# EAGLE design MTQHub (EAGLE 8.7.1)
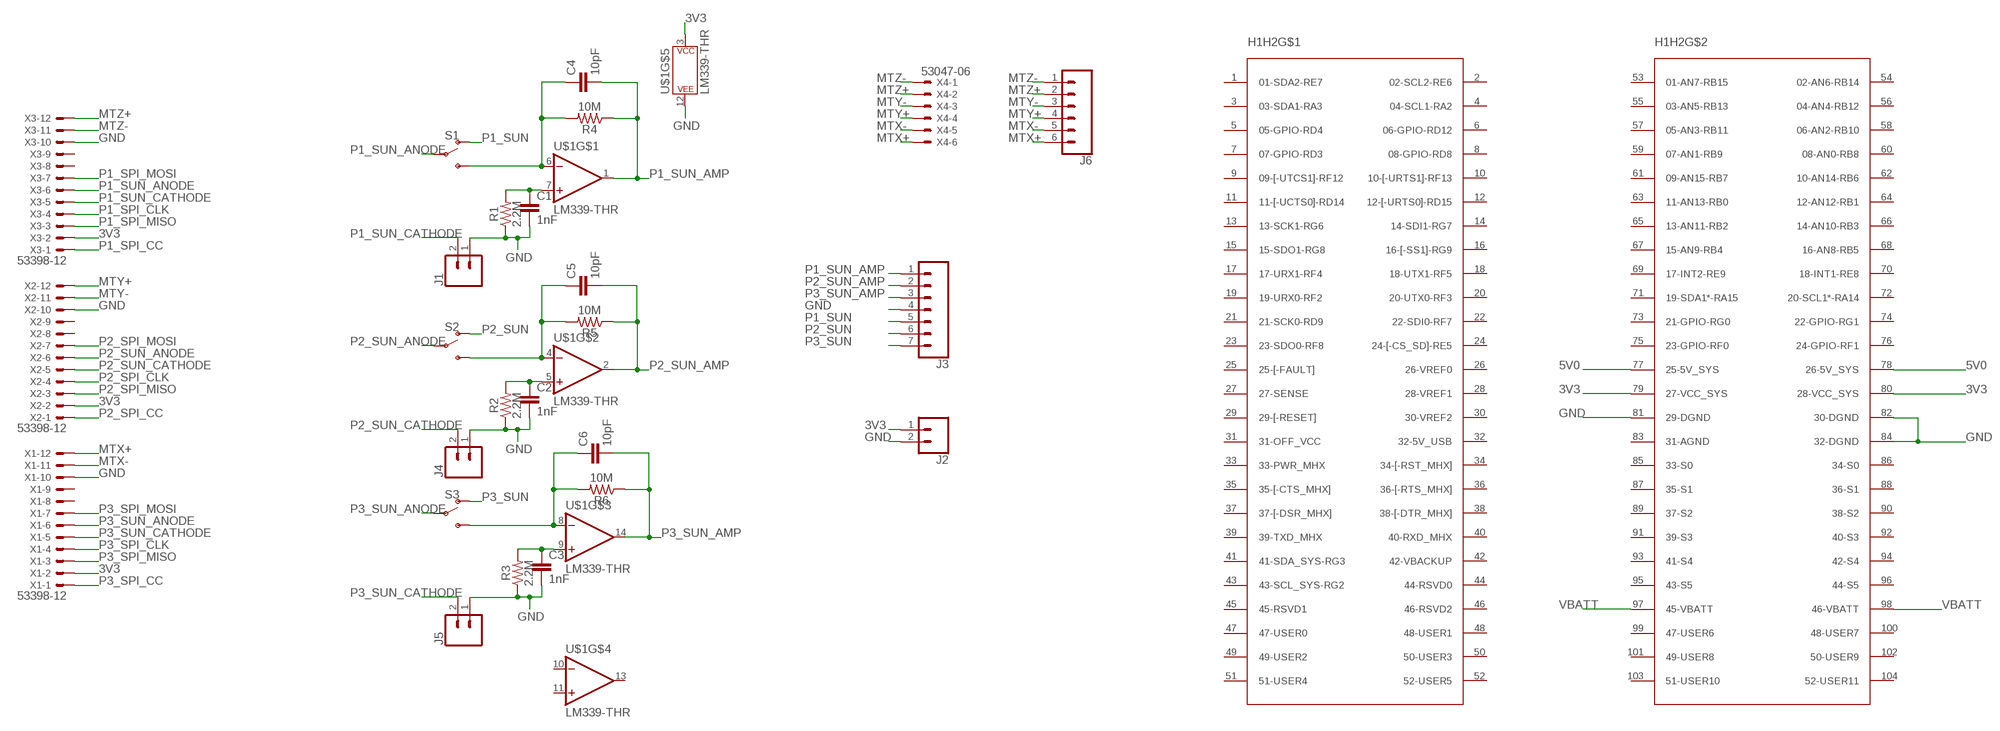
[diagram p0: schematic, sheet 1]

## Parts
C1  1nF  1.0NF/1000PF-0603-50V-10%  [0603]
C2  1nF  1.0NF/1000PF-0603-50V-10%  [0603]
C3  1nF  1.0NF/1000PF-0603-50V-10%  [0603]
C4  10pF  10PF-0603-50V-5%  [0603]
C5  10pF  10PF-0603-50V-5%  [0603]
C6  10pF  10PF-0603-50V-5%  [0603]
H1H2  PC104_CONN  [PC_104]
J1  CONN_02  [1X02]
J2  CONN_02  [1X02]
J3  CONN_07  [1X07]
J4  CONN_02  [1X02]
J5  CONN_02  [1X02]
J6  CONN_06SILK_FEMALE_PTH  [1X06]
R1  2.2M  RESISTOR0603  [0603]
R2  2.2M  RESISTOR0603  [0603]
R3  2.2M  RESISTOR0603  [0603]
R4  10M  RESISTOR0603  [0603]
R5  10M  RESISTOR0603  [0603]
R6  10M  RESISTOR0603  [0603]
S1  SWITCH-SPDT-PTH-11.6X4.0MM  [SWITCH_SPDT_PTH_11.6X4.0MM]
S2  SWITCH-SPDT-PTH-11.6X4.0MM  [SWITCH_SPDT_PTH_11.6X4.0MM]
S3  SWITCH-SPDT-PTH-11.6X4.0MM  [SWITCH_SPDT_PTH_11.6X4.0MM]
U$1  LM339-THR  [DIL14]
X1  53398-12  [53398-12]
X2  53398-12  [53398-12]
X3  53398-12  [53398-12]
X4  53047-06  [53047-06]

## Nets
3V3: H1H2.79(27-VCC_SYS) H1H2.80(28-VCC_SYS) J2.1 U$1.3(P$V+) X1.2 X2.2 X3.2
5V0: H1H2.77(25-5V_SYS) H1H2.78(26-5V_SYS)
GND: C1.2 C2.2 C3.2 H1H2.81(29-DGND) H1H2.82(30-DGND) H1H2.84(32-DGND) J1.1 J2.2 J3.4 J4.1 J5.1 R1.1 R2.1 R3.1 U$1.12(P$V-) X1.10 X2.10 X3.10
MTX+: J6.6 X1.12 X4.6
MTX-: J6.5 X1.11 X4.5
MTY+: J6.4 X2.12 X4.4
MTY-: J6.3 X2.11 X4.3
MTZ+: J6.2 X3.12 X4.2
MTZ-: J6.1 X3.11 X4.1
N$2: C1.1 R1.2 U$1.7(+IN)
N$4: C2.1 R2.2 U$1.5(+IN)
N$6: C3.1 R3.2 U$1.9(+IN)
N$9: C4.1 R4.2 S1.3(S) U$1.6(-IN)
N$11: C5.1 R5.2 S2.3(S) U$1.4(-IN)
N$13: C6.1 R6.2 S3.3(S) U$1.8(-IN)
P1_SPI_CC: X3.1
P1_SPI_CLK: X3.4
P1_SPI_MISO: X3.3
P1_SPI_MOSI: X3.7
P1_SUN: J3.5 S1.1(O)
P1_SUN_AMP: C4.2 J3.1 R4.1 U$1.1(OUT)
P1_SUN_ANODE: S1.2(P) X3.6
P1_SUN_CATHODE: J1.2 X3.5
P2_SPI_CC: X2.1
P2_SPI_CLK: X2.4
P2_SPI_MISO: X2.3
P2_SPI_MOSI: X2.7
P2_SUN: J3.6 S2.1(O)
P2_SUN_AMP: C5.2 J3.2 R5.1 U$1.2(OUT)
P2_SUN_ANODE: S2.2(P) X2.6
P2_SUN_CATHODE: J4.2 X2.5
P3_SPI_CC: X1.1
P3_SPI_CLK: X1.4
P3_SPI_MISO: X1.3
P3_SPI_MOSI: X1.7
P3_SUN: J3.7 S3.1(O)
P3_SUN_AMP: C6.2 J3.3 R6.1 U$1.14(OUT)
P3_SUN_ANODE: S3.2(P) X1.6
P3_SUN_CATHODE: J5.2 X1.5
VBATT: H1H2.97(45-VBATT) H1H2.98(46-VBATT)
Unconnected: H1H2.1(01-SDA2-RE7) H1H2.2(02-SCL2-RE6) H1H2.3(03-SDA1-RA3) H1H2.4(04-SCL1-RA2) H1H2.5(05-GPIO-RD4) H1H2.6(06-GPIO-RD12) H1H2.7(07-GPIO-RD3) H1H2.8(08-GPIO-RD8) H1H2.9(09-[-UTCS1]-RF12) H1H2.10(10-[-URTS1]-RF13) H1H2.11(11-[-UCTS0]-RD14) H1H2.12(12-[-URTS0]-RD15) H1H2.13(13-SCK1-RG6) H1H2.14(14-SDI1-RG7) H1H2.15(15-SDO1-RG8) H1H2.16(16-[-SS1]-RG9) H1H2.17(17-URX1-RF4) H1H2.18(18-UTX1-RF5) H1H2.19(19-URX0-RF2) H1H2.20(20-UTX0-RF3) H1H2.21(21-SCK0-RD9) H1H2.22(22-SDI0-RF7) H1H2.23(23-SDO0-RF8) H1H2.24(24-[-CS_SD]-RE5) H1H2.25(25-[-FAULT]) H1H2.26(26-VREF0) H1H2.27(27-SENSE) H1H2.28(28-VREF1) H1H2.29(29-[-RESET]) H1H2.30(30-VREF2) H1H2.31(31-OFF_VCC) H1H2.32(32-5V_USB) H1H2.33(33-PWR_MHX) H1H2.34(34-[-RST_MHX]) H1H2.35(35-[-CTS_MHX]) H1H2.36(36-[-RTS_MHX]) H1H2.37(37-[-DSR_MHX]) H1H2.38(38-[-DTR_MHX]) H1H2.39(39-TXD_MHX) H1H2.40(40-RXD_MHX) H1H2.41(41-SDA_SYS-RG3) H1H2.42(42-VBACKUP) H1H2.43(43-SCL_SYS-RG2) H1H2.44(44-RSVD0) H1H2.45(45-RSVD1) H1H2.46(46-RSVD2) H1H2.47(47-USER0) H1H2.48(48-USER1) H1H2.49(49-USER2) H1H2.50(50-USER3) H1H2.51(51-USER4) H1H2.52(52-USER5) H1H2.53(01-AN7-RB15) H1H2.54(02-AN6-RB14) H1H2.55(03-AN5-RB13) H1H2.56(04-AN4-RB12) H1H2.57(05-AN3-RB11) H1H2.58(06-AN2-RB10) H1H2.59(07-AN1-RB9) H1H2.60(08-AN0-RB8) H1H2.61(09-AN15-RB7) H1H2.62(10-AN14-RB6) H1H2.63(11-AN13-RB0) H1H2.64(12-AN12-RB1) H1H2.65(13-AN11-RB2) H1H2.66(14-AN10-RB3) H1H2.67(15-AN9-RB4) H1H2.68(16-AN8-RB5) H1H2.69(17-INT2-RE9) H1H2.70(18-INT1-RE8) H1H2.71(19-SDA1*-RA15) H1H2.72(20-SCL1*-RA14) H1H2.73(21-GPIO-RG0) H1H2.74(22-GPIO-RG1) H1H2.75(23-GPIO-RF0) H1H2.76(24-GPIO-RF1) H1H2.83(31-AGND) H1H2.85(33-S0) H1H2.86(34-S0) H1H2.87(35-S1) H1H2.88(36-S1) H1H2.89(37-S2) H1H2.90(38-S2) H1H2.91(39-S3) H1H2.92(40-S3) H1H2.93(41-S4) H1H2.94(42-S4) H1H2.95(43-S5) H1H2.96(44-S5) H1H2.99(47-USER6) H1H2.100(48-USER7) H1H2.101(49-USER8) H1H2.102(50-USER9) H1H2.103(51-USER10) H1H2.104(52-USER11) U$1.10(-IN) U$1.11(+IN) U$1.13(OUT) X1.8 X1.9 X2.8 X2.9 X3.8 X3.9

## Library data of the parts
C1-C3 = SparkFun-Capacitors:1.0NF/1000PF: 1nF/1,000pF ceramic capacitors A capacitor is a passive two-terminal electrical component used to store electrical energy temporarily in an electric field.; PROD_ID: CAP-07886
C4-C6 = SparkFun-Capacitors:10PF: 10pF ceramic capacitors A capacitor is a passive two-terminal electrical component used to store electrical energy temporarily in an electric field.; PROD_ID: CAP-11812
H1H2 = SUCHAI:PC104_CONN
J1 J2 J4 J5 = SparkFun-Connectors:CONN_02: Multi connection point. Often used as Generic Header-pin footprint for 0.1 inch spaced/style header connections On any of the 0.1 inch spaced packages, you can populate with these: Break Away Headers - Straight <https://www.sparkfun.com/products/116> (PRT-00116) Break Away Male Headers - Right Angle <https://www.sparkfun.com/products/553> (PRT-00553) Female Headers <https://www.sparkfun.com/products/115> (PRT-00115) Break Away Headers - Machine Pin <https://www.sparkfun.com/products/117> (PRT-00117) Break Away Female Headers - Swiss Machine Pin <https://www.sparkfun.com/products/743> (PRT-00743) For SCREWTERMINALS and SPRING TERMINALS visit here: Screw Terimnals on SparkFun.com <https://www.sparkfun.com/search/results?term=Screw+Terminals> (5mm/3.5mm/2.54mm spacing) This device is also useful as a general connection point to wire up your design to another part of your project. Our various solder wires solder well into these plated through hole pads. Hook-Up Wire - Assortment (Stranded, 22 AWG) <https://www.sparkfun.com/products/11375> (PRT-11375) Hook-Up Wire - Assortment (Solid Core, 22 AWG) <https://www.sparkfun.com/products/11367> (PRT-11367) View the entire wire category on our website here <https://www.sparkfun.com/categories/141> Special notes: Molex polarized connector foot print use with: PRT-08233 with associated crimp pins and housings. 2.54_SCREWTERM for use with PRT-10571. 3.5mm Screw Terminal footprints for PRT-08084 5mm Screw Terminal footprints for use with PRT-08432
J3 = SparkFun-Connectors:CONN_07: Multi connection point. Often used as Generic Header-pin footprint for 0.1 inch spaced/style header connections On any of the 0.1 inch spaced packages, you can populate with these: Break Away Headers - Straight <https://www.sparkfun.com/products/116> (PRT-00116) Break Away Male Headers - Right Angle <https://www.sparkfun.com/products/553> (PRT-00553) Female Headers <https://www.sparkfun.com/products/115> (PRT-00115) Break Away Headers - Machine Pin <https://www.sparkfun.com/products/117> (PRT-00117) Break Away Female Headers - Swiss Machine Pin <https://www.sparkfun.com/products/743> (PRT-00743) For SCREWTERMINALS and SPRING TERMINALS visit here: Screw Terimnals on SparkFun.com <https://www.sparkfun.com/search/results?term=Screw+Terminals> (5mm/3.5mm/2.54mm spacing) This device is also useful as a general connection point to wire up your design to another part of your project. Our various solder wires solder well into these plated through hole pads. Hook-Up Wire - Assortment (Stranded, 22 AWG) <https://www.sparkfun.com/products/11375> (PRT-11375) Hook-Up Wire - Assortment (Solid Core, 22 AWG) <https://www.sparkfun.com/products/11367> (PRT-11367) View the entire wire category on our website here <https://www.sparkfun.com/categories/141> Special notes: Molex polarized connector foot print use with SKU : PRT-08231 with associated crimp pins and housings. 1MM SMD Version SKU: PRT-10208 NOTES ON THE VARIANTS LOCK and LOCK_LONGPADS... This footprint was designed to help hold the alignment of a through-hole component (i.e. 6-pin header) while soldering it into place. You may notice that each hole has been shifted either up or down by 0.005 of an inch from it's more standard position (which is a perfectly straight line). This slight alteration caused the pins (the squares in the middle) to touch the edges of the holes. Because they are alternating, it causes a "brace" to hold the component in place. 0.005 has proven to be the perfect amount of "off-center" position when using our standard breakaway headers. Although looks a little odd when you look at the bare footprint, once you have a header in there, the alteration is very hard to notice. Also,if you push a header all the way into place, it is covered up entirely on the bottom side.
J6 = SparkFun-Connectors:CONN_06: Multi connection point. Often used as Generic Header-pin footprint for 0.1 inch spaced/style header connections On any of the 0.1 inch spaced packages, you can populate with these: Break Away Headers - Straight <https://www.sparkfun.com/products/116> (PRT-00116) Break Away Male Headers - Right Angle <https://www.sparkfun.com/products/553> (PRT-00553) Female Headers <https://www.sparkfun.com/products/115> (PRT-00115) Break Away Headers - Machine Pin <https://www.sparkfun.com/products/117> (PRT-00117) Break Away Female Headers - Swiss Machine Pin <https://www.sparkfun.com/products/743> (PRT-00743) Arduino Stackable Header - 6 Pin <https://www.sparkfun.com/products/9280> (PRT-09280) For SCREWTERMINALS and SPRING TERMINALS visit here: Screw Terimnals on SparkFun.com <https://www.sparkfun.com/search/results?term=Screw+Terminals> (5mm/3.5mm/2.54mm spacing) This device is also useful as a general connection point to wire up your design to another part of your project. Our various solder wires solder well into these plated through hole pads. Hook-Up Wire - Assortment (Stranded, 22 AWG) <https://www.sparkfun.com/products/11375> (PRT-11375) Hook-Up Wire - Assortment (Solid Core, 22 AWG) <https://www.sparkfun.com/products/11367> (PRT-11367) View the entire wire category on our website here <https://www.sparkfun.com/categories/141>; PROD_ID: CONN-08437
R1-R6 = SparkFun-Resistors:RESISTOR: Generic Resistor Package
S1-S3 = SparkFun-Switches:SWITCH-SPDT: Single Pole, Double Throw (SPDT) Switch Single-pole, double-throw (SPDT) switch. Variant Overview SMD-AYZ0202 Surface Mount DPDT Switch <https://www.sparkfun.com/products/597> (COM-00597) Used on e.g. LilyPad Arduino USB - ATmega32U4 Board <https://www.sparkfun.com/products/12049> PTH-11.6X4.0MM SPDT Mini Power Switch <https://www.sparkfun.com/products/102> (COM-00102) Used on e.g. SparkFun Simon Says - Through-Hole Soldering Kit <https://www.sparkfun.com/products/10547> (KIT-10547) PTH-11.6X4.0MM-KIT KIT version of SPDT Mini Power Switch - Simplifies soldering by removing tStop of switch pins - only one side can be soldered. PTH-11.6X4.0MM-LOCK LOCK version of SPDT Mini Power Switch - Offset pins hold switch in place for easier soldering. SMD-RIGHT-ANGLE Surface Mount Right Angle Switch <https://www.sparkfun.com/products/10860> (COM-10860) Used on e.g. SparkFun ESP8266 Thing <https://www.sparkfun.com/products/13231>; PROD_ID: SWCH-08261; SF_SKU: COM-00102
U$1 = BLDC_DRIVER:LM339-THR
X1-X3 = con-molex:53?-12: CONNECTOR wire to board 1.25 mm (.049 inch) pitch header; MF: MOLEX; OC_FARNELL: 1125356; OC_NEWARK: unknown
X4 = con-molex:53?-06: CONNECTOR wire to board 1.25 mm (.049 inch) pitch header; MF: MOLEX; MPN: 53047-0610-C; OC_FARNELL: 9733078; OC_NEWARK: 03M2965

## Board
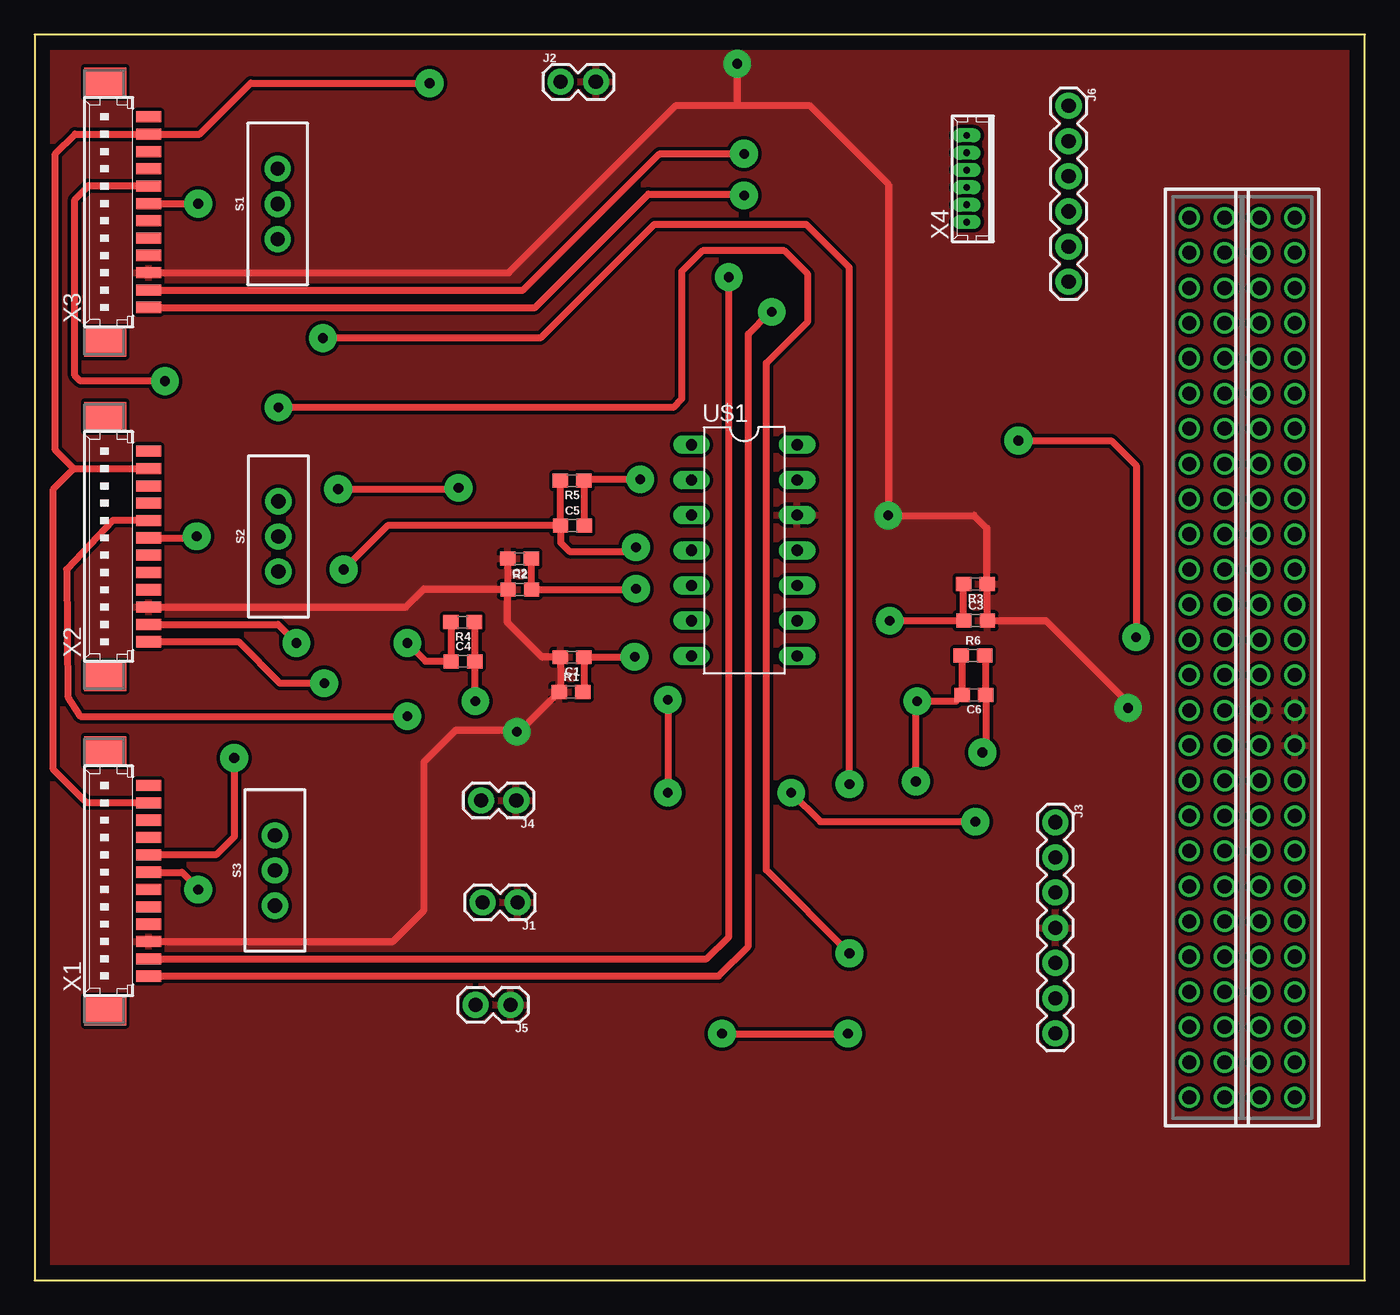
[diagram p1: board, top side]
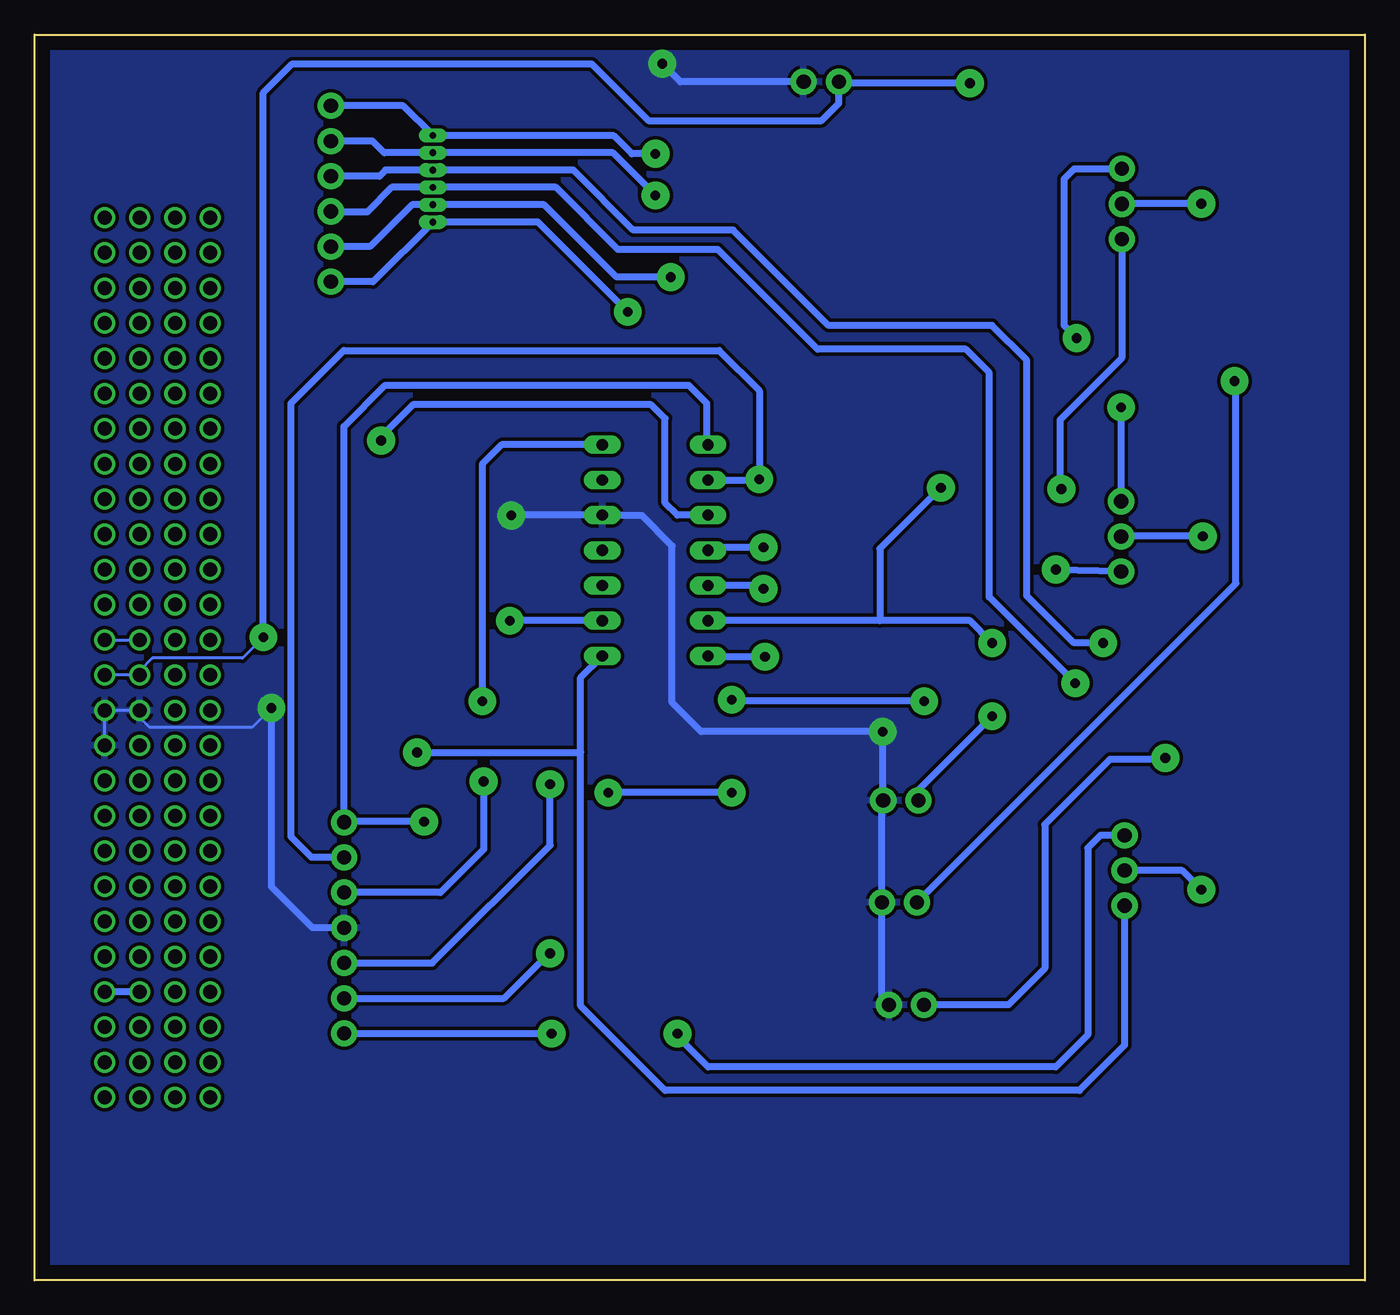
[diagram p2: board, bottom side, seen from below]

Size 96 x 89.9 mm. Coordinates in mm from the lower left corner, seen from the top.
Outline: 0,0 96,0 96,89.9 0,89.9 0,0
Copper layers (1*16): Top 0.035mm / dielectric 1.5mm / Bottom 0.035mm
Design rules "default": minimum track width 6mil, minimum drill 0.35mm, track to track 6mil, track to pad 6mil, pad to pad 6mil, via to via 6mil, smd to smd 6mil, copper to edge 40mil, drill to drill 6mil, minimum pad ring 10mil, minimum via ring 8mil, stop-mask expansion 4mil, vias tented up to drill 0mil, thermal gap 10mil

### Footprints (pad centres in the part's own frame; a part is rotated, then mirrored left to right if it is on the bottom)
0603 = smd 1.1 x 1: 1 -0.85,0; 2 0.85,0
PC_104 = drill 1.016 pad 1.524: 1 83.312,76.708; 2 85.852,76.708; 3 83.312,74.168; 4 85.852,74.168; 5 83.312,71.628; 6 85.852,71.628; 7 83.312,69.088; 8 85.852,69.088; 9 83.312,66.548; 10 85.852,66.548; 11 83.312,64.008; 12 85.852,64.008; 13 83.312,61.468; 14 85.852,61.468; 15 83.312,58.928; 16 85.852,58.928; 17 83.312,56.388; 18 85.852,56.388; 19 83.312,53.848; 20 85.852,53.848; 21 83.312,51.308; 22 85.852,51.308; 23 83.312,48.768; 24 85.852,48.768; 25 83.312,46.228; 26 85.852,46.228; 27 83.312,43.688; 28 85.852,43.688; 29 83.312,41.148; 30 85.852,41.148; 31 83.312,38.608; 32 85.852,38.608; 33 83.312,36.068; 34 85.852,36.068; 35 83.312,33.528; 36 85.852,33.528; 37 83.312,30.988; 38 85.852,30.988; 39 83.312,28.448; 40 85.852,28.448; 41 83.312,25.908; 42 85.852,25.908; 43 83.312,23.368; 44 85.852,23.368; 45 83.312,20.828; 46 85.852,20.828; 47 83.312,18.288; 48 85.852,18.288; 49 83.312,15.748; 50 85.852,15.748; 51 83.312,13.208; 52 85.852,13.208; 53 88.392,76.708; 54 90.932,76.708; 55 88.392,74.168; 56 90.932,74.168; 57 88.392,71.628; 58 90.932,71.628; 59 88.392,69.088; 60 90.932,69.088; 61 88.392,66.548; 62 90.932,66.548; 63 88.392,64.008; 64 90.932,64.008; 65 88.392,61.468; 66 90.932,61.468; 67 88.392,58.928; 68 90.932,58.928; 69 88.392,56.388; 70 90.932,56.388; 71 88.392,53.848; 72 90.932,53.848; 73 88.392,51.308; 74 90.932,51.308; 75 88.392,48.768; 76 90.932,48.768; 77 88.392,46.228; 78 90.932,46.228; 79 88.392,43.688; 80 90.932,43.688; 81 88.392,41.148; 82 90.932,41.148; 83 88.392,38.608; 84 90.932,38.608; 85 88.392,36.068; 86 90.932,36.068; 87 88.392,33.528; 88 90.932,33.528; 89 88.392,30.988; 90 90.932,30.988; 91 88.392,28.448; 92 90.932,28.448; 93 88.392,25.908; 94 90.932,25.908; 95 88.392,23.368; 96 90.932,23.368; 97 88.392,20.828; 98 90.932,20.828; 99 88.392,18.288; 100 90.932,18.288; 101 88.392,15.748; 102 90.932,15.748; 103 88.392,13.208; 104 90.932,13.208
1X02 = drill 1.016 pad 1.88: 1 0,0; 2 2.54,0
1X07 = drill 1.016 pad 1.88: 1 0,0; 2 2.54,0; 3 5.08,0; 4 7.62,0; 5 10.16,0; 6 12.7,0; 7 15.24,0
1X06 = drill 1.016 pad 1.88: 1 0,0; 2 2.54,0; 3 5.08,0; 4 7.62,0; 5 10.16,0; 6 12.7,0
SWITCH_SPDT_PTH_11.6X4.0MM = drill 1.016 pad 1.88: 1 0,2.54; 2 0,0; 3 0,-2.54
DIL14 = drill 0.813 long: 1 -7.62,-3.81; 2 -5.08,-3.81; 3 -2.54,-3.81; 4 0,-3.81; 5 2.54,-3.81; 6 5.08,-3.81; 7 7.62,-3.81; 8 7.62,3.81; 9 5.08,3.81; 10 2.54,3.81; 11 0,3.81; 12 -2.54,3.81; 13 -5.08,3.81; 14 -7.62,3.81
53398-12 = smd 0.8 x 1.8: 1 6.875,-2.5; 2 5.625,-2.5; 3 4.375,-2.5; 4 3.125,-2.5; 5 1.875,-2.5; 6 0.625,-2.5; 7 -0.625,-2.5; 8 -1.875,-2.5; 9 -3.125,-2.5; 10 -4.375,-2.5; 11 -5.625,-2.5; 12 -6.875,-2.5 | smd 2.1 x 3: S1 9.375,0.625; S2 -9.375,0.625
53047-06 = drill 0.5 pad 0.698 long: 1 3.125,0.45; 2 1.875,0.45; 3 0.625,0.45; 4 -0.625,0.45; 5 -1.875,0.45; 6 -3.125,0.45

### Placement (x,y rotation side)
C1  38.79,44.97 180 top
C2  34.99,52.08 180 top
C3  67.91,47.61 0 top
C4  30.91,44.67 0 top
C5  38.81,54.46 0 top
C6  67.79,42.25 180 top
H1H2  0.02,-0.01 0 top
J1  34.86,27.28 180 top
J2  37.96,86.49 0 top
J3  73.67,33.06 270 top
J4  34.76,34.63 180 top
J5  34.36,19.88 180 top
J6  74.62,84.76 270 top
R1  38.71,42.46 0 top
R2  35.01,49.85 0 top
R3  67.89,50.26 180 top
R4  30.89,47.5 180 top
R5  38.79,57.71 180 top
R6  67.71,45.08 0 top
S1  17.54,77.68 0 top
S2  17.59,53.68 0 top
S3  17.34,29.58 0 top
U$1  51.22,52.68 270 top
X1  5.72,28.83 90 top
X2  5.72,52.96 90 top
X3  5.72,77.09 90 top
X4  67.71,79.5 90 top

### Tracks (layer width: path | path; a pad name or v marks a point on that pad's centre or on a via)
3V3  (via drill 0.7 pad 2)
  Top 0.508: 28.6,86.4 v28.5,86.4 15.6,86.4 11.91,82.72 X3.2 2.91,82.72 1.5,81.3 1.5,59.92 2.83,58.59 | v71,60.6 77.7,60.6 79.5,58.8 v79.5,46.4 79.3,46.2 | X1.2 3.74,34.46 1.35,36.85 1.35,57.1 2.83,58.59 | 2.83,58.59 X2.2
  Bottom 0.2: v79.5,46.4 81,44.9 87.5,44.9 88.41,43.99 H1H2.79 H1H2.80
  Bottom 0.508: v28.5,86.4 37.87,86.4 J2.1 37.96,84.94 39.2,83.7 51.7,83.7 55.8,87.8 77.4,87.8 79.5,85.7 v79.5,46.4 | U$1.3 49.62,55.22 50.5,56.1 50.5,62.2 51.5,63.2 68.7,63.2 71.3,60.6 v71,60.6
5V0
  Bottom 0.2: H1H2.78 H1H2.77
GND  (via drill 0.7 pad 2)
  Top 0.508: C2.2 34.14,49.87 | 34.14,49.87 R2.1 | 34.14,49.8 34.14,47.54 34.1,47.5 36.63,44.97 C1.2 37.94,42.54 R1.1 35.05,39.65 | 34.14,49.8 34.14,49.87 | X2.10 26.79,48.59 28.1,49.9 34.04,49.9 34.14,49.8 | 35.05,39.65 34.9,39.5 34.8,39.5 v34.8,39.6 | v78.91,41.3 79.01,41.2 79.4,41.2 72.99,47.61 C3.2 68.74,47.63 R3.1 68.7,50.3 68.7,54.3 67.8,55.2 v61.6,55.2 61.6,79.1 55.9,84.8 50.8,84.8 | X1.10 25.85,24.46 28.1,26.7 28.1,37.4 30.4,39.7 35,39.7 35.05,39.65 | X3.10 34.22,72.72 46.3,84.8 50.8,84.8 | v50.7,87.8 50.7,84.9 50.8,84.8
  Bottom 0.2: v78.91,41.3 80.31,39.9 87.7,39.9 88.41,40.61 H1H2.81 H1H2.82 H1H2.84
  Bottom 0.508: 34.8,34.67 v34.8,39.6 47.9,39.6 50,41.7 50,53 52.22,55.22 U$1.12 61.58,55.22 v61.6,55.2 | 34.8,34.67 J4.1 | J5.1 34.86,20.38 J1.1 34.86,34.61 34.8,34.67 | J3.4 75.94,25.44 78.91,28.41 v78.91,41.3 | J2.2 49.39,86.49 v50.7,87.8
  pour Top (isolate 0.254): 0,0 0,90.1 96,90.1 96,0.1 96.1,0
  pour Bottom (isolate 0.254): -0.1,90.1 95.9,90.1 96,90.2 96,0.1 96.1,0 0,0 0,0.1 0.1,0.1
MTX+  (via drill 0.7 pad 2)
  Top 0.508: X1.12 49.35,21.96 51.5,24.1 51.5,68.3 53,69.8 53.1,69.8 v53.2,69.9
  Bottom 0.508: v53.2,69.9 59.67,76.38 X4.6 71.58,72.06 J6.6
MTX-  (via drill 0.7 pad 2)
  Top 0.508: X1.11 48.5,23.21 50.1,24.8 50.1,72.1 50.2,72.2 50.2,72.3 v50.1,72.4
  Bottom 0.508: v50.1,72.4 54,72.4 59.23,77.62 X4.5 68.78,77.62 71.8,74.6 J6.5
MTY+  (via drill 0.7 pad 2)
  Top 0.508: X2.12 14.71,46.09 17.7,43.1 v20.9,43.1 21,43.1 21.1,43.2
  Bottom 0.508: v20.9,43.1 27.1,49.3 27.1,65.5 28.8,67.2 39.5,67.2 46.7,74.4 53.9,74.4 58.38,78.88 X4.4 70.22,78.88 72,77.1 74.58,77.1 J6.4
MTY-  (via drill 0.7 pad 2)
  Top 0.508: X2.11 17.56,47.34 v18.9,46
  Bottom 0.508: v18.9,46 21,46 24.4,49.4 24.4,66.4 26.9,68.9 38.7,68.9 45.6,75.8 52.8,75.8 57.12,80.12 X4.3 70.67,80.12 71.12,79.68 J6.3
MTZ+  (via drill 0.7 pad 2)
  Top 0.508: X3.12 36.11,70.22 44.3,78.4 51.1,78.4 v51.2,78.3
  Bottom 0.508: v51.2,78.3 54.27,81.38 X4.2 70.78,81.38 71.62,82.22 J6.2
MTZ-  (via drill 0.7 pad 2)
  Top 0.508: X3.11 35.27,71.47 45.1,81.3 v51.2,81.3
  Bottom 0.508: v51.2,81.3 52.9,81.3 54.2,82.6 67.23,82.6 X4.1 69.39,84.76 J6.1
N$2  (via drill 0.7 pad 2)
  Top 0.508: R1.2 39.64,42.54 C1.1 43.37,44.97 43.4,45 v43.3,45
  Bottom 0.508: v43.3,45 47.35,45 U$1.7
N$4  (via drill 0.7 pad 2)
  Top 0.508: C2.1 35.84,49.87 R2.2 43.35,49.85 43.4,49.8 v43.4,49.9
  Bottom 0.508: v43.4,49.9 43.64,50.14 U$1.5
N$6  (via drill 0.7 pad 2)
  Top 0.508: C3.1 67.04,47.63 | 67.04,47.63 R3.2 | v61.7,47.6 67.01,47.6 67.04,47.63
  Bottom 0.508: U$1.9 v61.7,47.6
N$9  (via drill 0.7 pad 2)
  Top 0.508: R4.2 30.04,44.69 | 30.04,44.69 C4.1 | v26.9,46 28.21,44.69 30.04,44.69 | v21.9,57.1 30.6,57.1 30.7,57 30.7,57.1 v30.6,57.2
  Bottom 0.508: v26.9,46 28.5,47.6 35,47.6 | 35,47.6 U$1.6 | S1.3 17.54,66.56 22,62.1 22,57 | 22,56.9 22,57 | 22,57 v21.9,57.1 | v30.6,57.2 35,52.8 35,47.6
N$11  (via drill 0.7 pad 2)
  Top 0.508: C5.1 37.96,57.69 R5.2 | C5.1 37.96,53.24 38.6,52.6 43.3,52.6 43.3,52.8 v43.4,52.9 | v22.3,51.3 25.46,54.46 C5.1
  Bottom 0.508: v22.3,51.3 17.65,51.2 S2.3 | v43.4,52.9 47.19,52.9 U$1.4
N$13  (via drill 0.7 pad 2)
  Top 0.508: R6.2 68.64,45 C6.1 68.64,38.34 v68.4,38.1
  Bottom 0.508: S3.3 17.34,16.96 20.6,13.7 50.5,13.7 56.6,19.8 56.6,38.1 | U$1.8 56.6,43.49 56.6,38.1 | v68.4,38.1 56.6,38.1
P1_SUN  (via drill 0.7 pad 2)
  Top 0.508: v58.8,35.8 58.8,73.1 55.7,76.2 44.7,76.2 36.5,68 v20.8,68
  Bottom 0.508: J3.5 67.3,22.9 58.8,31.4 v58.8,35.8 59.1,35.9 | v20.8,68 21.7,68.9 21.7,79.5 20.98,80.22 S1.1
P1_SUN_AMP  (via drill 0.7 pad 2)
  Top 0.508: R4.1 31.76,47.48 C4.2 31.76,42.04 31.8,42 v31.8,41.8 | v45.7,41.9 v45.7,35.2 | v54.6,35.2 56.7,33.1 v67.9,33.1
  Bottom 0.508: U$1.1 47.5,60.39 47.5,63.3 48.8,64.6 70.7,64.6 73.67,61.63 J3.1 73.63,33.1 v67.9,33.1 | v31.8,41.8 45.7,41.8 v45.7,41.9 | v45.7,35.2 v54.6,35.2
P1_SUN_ANODE  (via drill 0.7 pad 2)
  Top 0.508: X3.6 11.68,77.72 11.7,77.7 v11.8,77.7
  Bottom 0.508: v11.8,77.7 17.52,77.7 S1.2
P1_SUN_CATHODE  (via drill 0.7 pad 2)
  Top 0.508: v9.4,64.9 3.3,64.9 2.9,65.3 2.9,78 3.9,79 8.18,79 X3.5
  Bottom 0.508: J1.2 9.3,50.3 9.3,64.9 v9.4,64.9
P2_SUN  (via drill 0.7 pad 2)
  Top 0.508: v58.8,23.6 52.8,29.6 52.8,66.2 55.8,69.2 55.8,72.6 54.1,74.3 48.2,74.3 46.7,72.8 46.7,63.6 46.1,63 v17.6,63
  Bottom 0.508: J3.6 62.14,20.36 59,23.5 58.9,23.5 v58.8,23.6 | v17.6,63 S2.1
P2_SUN_AMP  (via drill 0.7 pad 2)
  Top 0.508: v43.7,57.8 39.73,57.8 R5.1 39.64,54.48 C5.2
  Bottom 0.508: U$1.2 43.86,57.76 43.8,57.7 v43.7,57.8 43.7,64.2 46.6,67.1 73.7,67.1 77.5,63.3 77.5,32 76.02,30.52 J3.2
P2_SUN_ANODE  (via drill 0.7 pad 2)
  Top 0.508: X2.6 11.38,53.59 11.5,53.7 v11.7,53.7
  Bottom 0.508: v11.7,53.7 17.57,53.7 S2.2
P2_SUN_CATHODE  (via drill 0.7 pad 2)
  Top 0.508: X2.5 5.63,54.84 2.3,51.3 2.4,42.1 3.3,40.7 v26.9,40.7 27,40.7
  Bottom 0.508: v26.9,40.7 32.22,35.38 J4.2
P3_SUN  (via drill 0.7 pad 2)
  Top 0.508: v49.6,17.8 v58.7,17.8
  Bottom 0.508: S3.1 19.08,32.12 20,31.2 20,17.7 22.3,15.4 47.4,15.4 49.7,17.7 v49.6,17.8 | v58.7,17.8 73.65,17.8 J3.7
P3_SUN_AMP  (via drill 0.7 pad 2)
  Top 0.508: R6.1 66.94,45 C6.2 66.49,41.8 v63.7,41.8 63.6,41.7 v63.6,36
  Bottom 0.508: U$1.14 62.3,60.3 63.7,58.9 v63.7,41.8 | J3.3 66.72,27.98 63.6,31.1 v63.6,36
P3_SUN_ANODE  (via drill 0.7 pad 2)
  Top 0.508: X1.6 10.64,29.46 11.8,28.3 v11.8,28.2
  Bottom 0.508: v11.8,28.2 13.18,29.58 S3.2
P3_SUN_CATHODE  (via drill 0.7 pad 2)
  Top 0.508: v14.4,37.7 14.4,32 13.1,30.7 X1.5
  Bottom 0.508: 14.5,37.7 14.4,37.6 | 14.4,37.6 v14.4,37.7 | 14.4,37.6 18.4,37.6 23.1,32.9 23.1,22.5 25.72,19.88 J5.2
VBATT
  Bottom 0.508: H1H2.97 H1H2.98